# EasyEDA schematic 1-Schematic_OSAB-RP2040-Mainboard-v1.0.0.json
TITLE: OSAB Mainboard [RP2040]; REV: 1.0.0; Date: 2024-08-22; Sheet: 1/1; Drawn By: Michael MacDonald; Company: OSAB Project
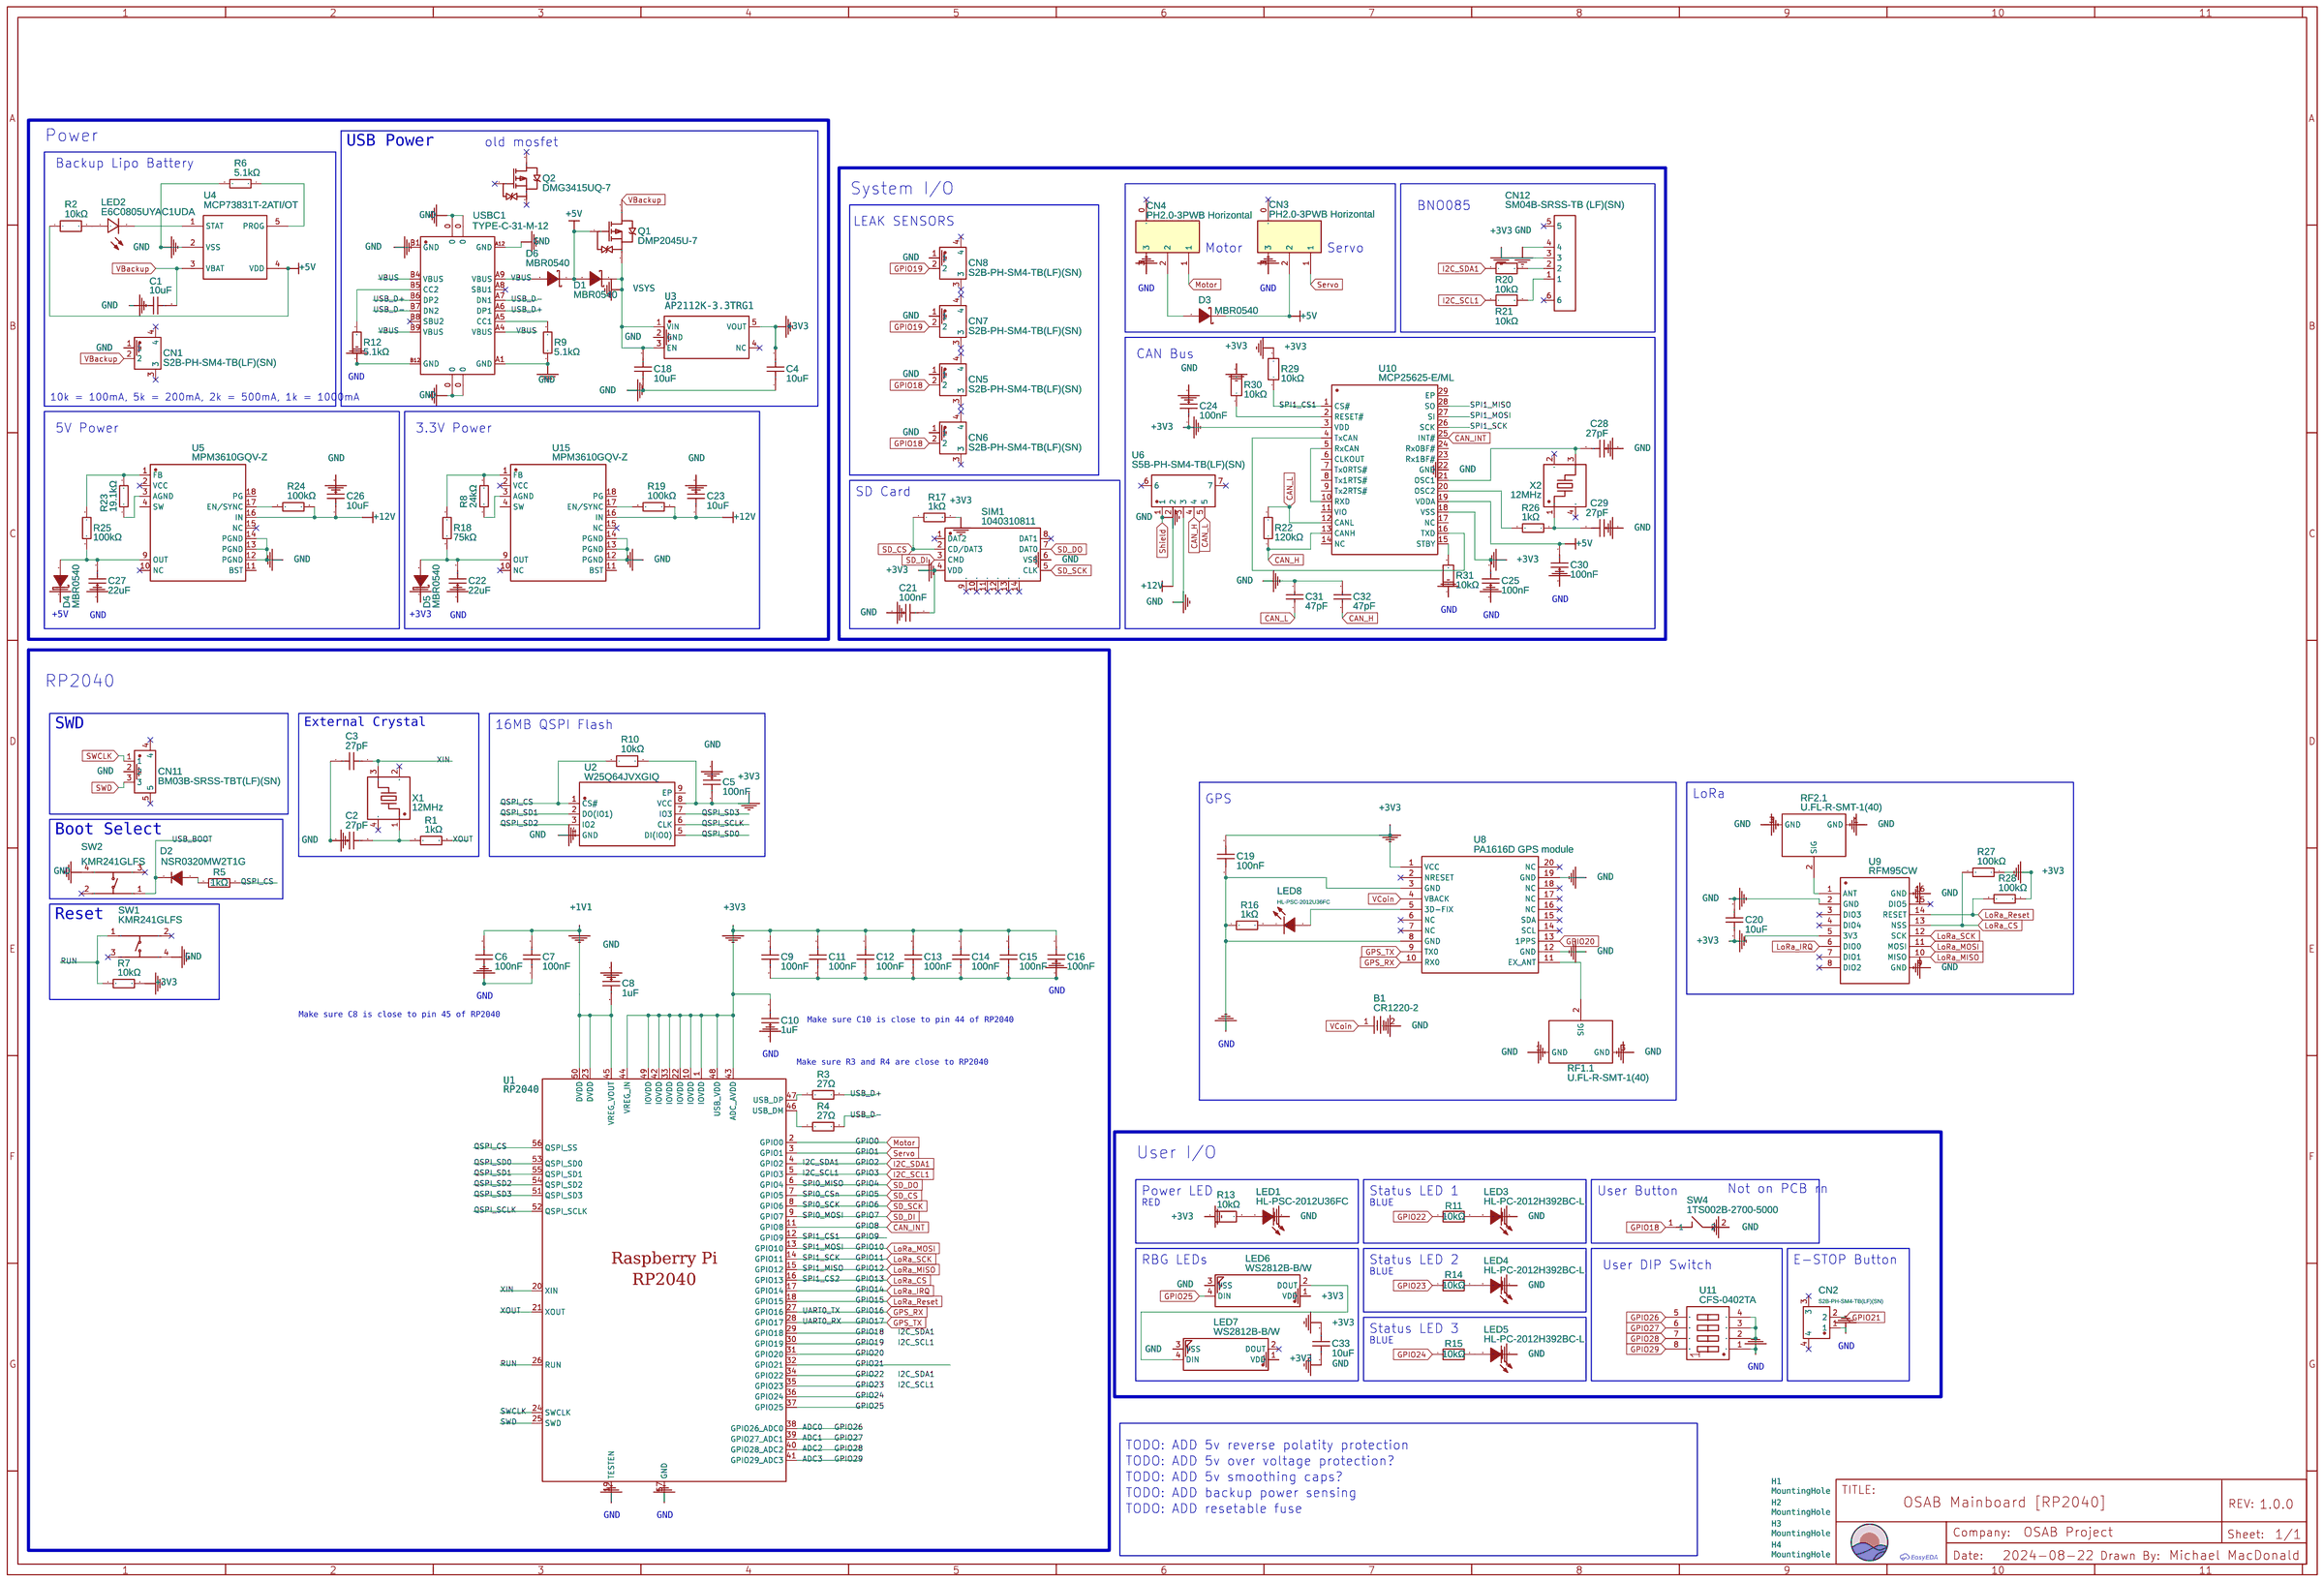
[diagram p0: schematic sheet]

## Parts
B1  CR1220-2  [BAT-SMD_CR1220-2]
C1  10uF  [C0603]
C2  27pF  [C0402]
C3  27pF  [C0402]
C4  10uF  [C0603]
C5  100nF  [C0402]
C6  100nF  [C0402]
C7  100nF  [C0402]
C8  1uF  [C0402]
C9  100nF  [C0402]
C10  1uF  [C0402]
C11  100nF  [C0402]
C12  100nF  [C0402]
C13  100nF  [C0402]
C14  100nF  [C0402]
C15  100nF  [C0402]
C16  100nF  [C0402]
C18  10uF  [C0603]
C19  100nF  [C0402]
C20  10uF  [C0603]
C21  100nF  [C0402]
C22  22uF  [C0603]
C23  10uF  [C0603]
C24  100nF  [C0402]
C25  100nF  [C0402]
C26  10uF  [C0603]
C27  22uF  [C0603]
C28  27pF  [C0402]
C29  27pF  [C0402]
C30  100nF  [C0402]
C31  47pF  [C0603]
C32  47pF  [C0603]
C33  10uF  [C0603]
CN1  S2B-PH-SM4-TB(LF)(SN)  [CONN-SMD_P2.00_S2B-PH-SM4-TB-LF-SN]
CN2  S2B-PH-SM4-TB(LF)(SN)  [CONN-SMD_P2.00_S2B-PH-SM4-TB-LF-SN]
CN3  PH2.0-3PWB Horizontal  [CONN-TH_PH-3PWB]
CN4  PH2.0-3PWB Horizontal  [CONN-TH_PH-3PWB]
CN5  S2B-PH-SM4-TB(LF)(SN)  [CONN-SMD_P2.00_S2B-PH-SM4-TB-LF-SN]
CN6  S2B-PH-SM4-TB(LF)(SN)  [CONN-SMD_P2.00_S2B-PH-SM4-TB-LF-SN]
CN7  S2B-PH-SM4-TB(LF)(SN)  [CONN-SMD_P2.00_S2B-PH-SM4-TB-LF-SN]
CN8  S2B-PH-SM4-TB(LF)(SN)  [CONN-SMD_P2.00_S2B-PH-SM4-TB-LF-SN]
CN11  BM03B-SRSS-TBT(LF)(SN)  [CONN-SMD_BM03B-SRSS-TBT-LF-SN]
CN12  SM04B-SRSS-TB (LF)(SN)  [CONN-SMD_4P-P1.00_SM04B-SRSS-TB-LF-SN]
D1  MBR0540  [SOD-123FL_L2.7-W1.8-LS3.8-RD]
D2  NSR0320MW2T1G  [SOD-323_L1.8-W1.3-LS2.5-RD]
D3  MBR0540  [SOD-123FL_L2.7-W1.8-LS3.8-RD]
D4  MBR0540  [SOD-123FL_L2.7-W1.8-LS3.8-RD]
D5  MBR0540  [SOD-123FL_L2.7-W1.8-LS3.8-RD]
D6  MBR0540  [SOD-123FL_L2.7-W1.8-LS3.8-RD]
H1  MountingHole  [MOUNTINGHOLE_2.7MM_M2.5]
H2  MountingHole  [MOUNTINGHOLE_2.7MM_M2.5]
H3  MountingHole  [MOUNTINGHOLE_2.7MM_M2.5]
H4  MountingHole  [MOUNTINGHOLE_2.7MM_M2.5]
LED1  HL-PSC-2012U36FC  [LED0805-RD_RED]
LED2  E6C0805UYAC1UDA  [LED0805-R-RD]
LED3  HL-PC-2012H392BC-L  [LED0805-RD_BLUE]
LED4  HL-PC-2012H392BC-L  [LED0805-RD_BLUE]
LED5  HL-PC-2012H392BC-L  [LED0805-RD_BLUE]
LED6  WS2812B-B/W  [LED-SMD_4P-L5.0-W5.0-TL_WS2812B-B]
LED7  WS2812B-B/W  [LED-SMD_4P-L5.0-W5.0-TL_WS2812B-B]
LED8  HL-PSC-2012U36FC  [LED0805-RD_RED]
Q1  DMP2045U-7  [SOT-23-3_L2.9-W1.3-P1.90-LS2.4-BR-CW]
Q2  DMG3415UQ-7  [SOT-23-3_L2.9-W1.6-P1.90-LS2.8-BR]
R1  1kΩ  [R0603]
R2  10kΩ  [R0603]
R3  27Ω  [R0402]
R4  27Ω  [R0402]
R5  1kΩ  [R0603]
R6  5.1kΩ  [R0603]
R7  10kΩ  [R0603]
R8  24kΩ  [R0603]
R9  5.1kΩ  [R0603]
R10  10kΩ  [R0603]
R11  10kΩ  [R0603]
R12  5.1kΩ  [R0603]
R13  10kΩ  [R0603]
R14  10kΩ  [R0603]
R15  10kΩ  [R0603]
R16  1kΩ  [R0603]
R17  1kΩ  [R0603]
R18  75kΩ  [R0603]
R19  100kΩ  [R0603]
R20  10kΩ  [R0603]
R21  10kΩ  [R0603]
R22  120kΩ  [R0603]
R23  19.1kΩ  [R0603]
R24  100kΩ  [R0603]
R25  100kΩ  [R0603]
R26  1kΩ  [R0603]
R27  100kΩ  [R0603]
R28  100kΩ  [R0603]
R29  10kΩ  [R0603]
R30  10kΩ  [R0603]
R31  10kΩ  [R0603]
RF1  U.FL-R-SMT-1(40)  [ANT-SMD_UFL-R-SMT-1]  (section 1)
RF2  U.FL-R-SMT-1(40)  [ANT-SMD_UFL-R-SMT-1]  (section 1)
SIM1  1040310811  [SIM-SMD_8P-1040310811]
SW1  KMR241GLFS  [KEY-SMD_4P-L4.2-W2.8-P1.60-LS4.6]
SW2  KMR241GLFS  [KEY-SMD_4P-L4.2-W2.8-P1.60-LS4.6]
SW4  1TS002B-2700-5000  [SW-SMD_L6.0-W3.5-LS8.0]
U1  RP2040  [LQFN-56_L7.0-W7.0-P0.4-EP]
U2  W25Q64JVXGIQ  [XSON-8_L4.0-W4.0-P0.80-TL-EP]
U3  AP2112K-3.3TRG1  [SOT-25-5_L3.0-W1.8-P0.95-LS3.0-BR]
U4  MCP73831T-2ATI/OT  [SOT-23-5_L3.0-W1.7-P0.95-LS2.8-BR]
U5  MPM3610GQV-Z  [QFN-20_L5.0-W3.0-TL-MPM3610GQV-Z]
U6  S5B-PH-SM4-TB(LF)(SN)  [CONN-SMD_S5B-PH-SM4-TB-LF-SN]
U8  PA1616D GPS module  [PA1616D GPS MODULE]
U9  RFM95CW  [RFM95CW]
U10  MCP25625-E/ML  [QFN-28_L6.0-W6.0-P0.65-BL-EP]
U11  CFS-0402TA  [SW-SMD_8P-L11.1-W6.2-P2.54-LS7.8]
U15  MPM3610GQV-Z  [QFN-20_L5.0-W3.0-TL-MPM3610GQV-Z]
USBC1  TYPE-C-31-M-12  [USB-C_SMD-TYPE-C-31-M-12]
X1  12MHz  [CRYSTAL-SMD_4P-L3.2-W2.5-BL]
X2  12MHz  [CRYSTAL-SMD_4P-L3.2-W2.5-BL]

## Library data of the parts
B1 = CR1220-2: Supplier: LCSC; Manufacturer: Q&J; image: //image.lceda.cn/szlcsc/C70381.jpg; Supplier Part: C70381
C1 C4 C18 C20 C23 C26 C33 = CSA0603X5R106M6R3JT: Contributor: lcsc; Supplier: LCSC; Supplier Part: C3015157; Manufacturer: HRE(芯声); JLCPCB Part Class: Extended Part
C2 C3 C28 C29 = GJM1555C1H270JB01D: Supplier: LCSC; Manufacturer: muRata(村田); Supplier Part: C88884; JLCPCB Part Class: Extended Part
C5-C7 C9 C11-C16 C19 C21 C24 C25 C30 = GCM155R71C104KA55D: Supplier: LCSC; Manufacturer: muRata(村田); Supplier Part: C85857; JLCPCB Part Class: Extended Part
C8 C10 = TCC0402X5R105K100AT: Contributor: LCSC; Supplier: LCSC; Supplier Part: C380293; Manufacturer: CCTC(三环); JLCPCB Part Class: Extended Part
C22 C27 = CL10A226MQ8NRNC: Supplier: LCSC; Manufacturer: SAMSUNG(三星); Supplier Part: C59461; JLCPCB Part Class: Basic Part
C31 C32 = CL10C470JB8NNNC: Supplier: LCSC; Manufacturer: SAMSUNG(三星); Supplier Part: C1671; JLCPCB Part Class: Basic Part
CN1 CN2 CN5-CN8 = S2B-PH-SM4-TB(LF)(SN): Contributor: LCSC; Supplier: LCSC; Supplier Part: C295747; Manufacturer: JST; JLCPCB Part Class: Extended Part
CN3 CN4 = PH2.0-3PWB Horizontal: Supplier: LCSC; Manufacturer: BOOMELE(博穆精密); Manufacturer Part: PH-3P卧贴; Supplier Part: C81626; JLCPCB Part Class: Extended Part
CN11 = BM03B-SRSS-TBT(LF)(SN): Contributor: LCSC; Supplier: LCSC; Supplier Part: C495538; Manufacturer: JST; JLCPCB Part Class: Extended Part
CN12 = SM04B-SRSS-TB (LF)(SN): Contributor: LCSC; Supplier: LCSC; Supplier Part: C160404; Manufacturer: JST; Manufacturer Part: SM04B-SRSS-TB(LF)(SN); JLCPCB Part Class: Extended Part
D1 D3-D6 = MBR0540: Contributor: LCSC; Supplier: LCSC; Supplier Part: C116159; Manufacturer: SHIKUES(时科); JLCPCB Part Class: Extended Part
D2 = NSR0320MW2T1G: Supplier: LCSC; Manufacturer: onsemi(安森美); Supplier Part: C48192; JLCPCB Part Class: Extended Part
LED1 LED8 = HL-PSC-2012U36FC: Contributor: LCSC; Supplier: LCSC; Supplier Part: C497949; Manufacturer: HONGLITRONIC(鸿利光电); JLCPCB Part Class: Extended Part
LED2 = E6C0805UYAC1UDA: Contributor: LCSC; Supplier: LCSC; Supplier Part: C375452; Manufacturer: ekinglux(亿晶源); JLCPCB Part Class: Extended Part
LED3-LED5 = HL-PC-2012H392BC-L: Contributor: LCSC; Supplier: LCSC; Supplier Part: C497943; Manufacturer: HONGLITRONIC(鸿利光电); JLCPCB Part Class: Extended Part
LED6 LED7 = WS2812B-B/W: Contributor: LCSC; Supplier: LCSC; Supplier Part: C2761795; Manufacturer: worldsemi; Manufacturer Part: WS2812B-B/T; JLCPCB Part Class: Extended Part
Q1 = DMP2045U-7: Contributor: LCSC; Supplier: LCSC; Supplier Part: C459541; Manufacturer: DIODES(美台); JLCPCB Part Class: Extended Part
Q2 = DMG3415UQ-7: Contributor: LCSC; Supplier: LCSC; Supplier Part: C459537; Manufacturer: DIODES(美台); JLCPCB Part Class: Extended Part
R1 R5 R16 R17 R26 = 0603WAF1001T5E: Supplier: LCSC; Manufacturer: UNI-ROYAL(厚声); Supplier Part: C21190; JLCPCB Part Class: Basic Part
R2 R10 R11 R13-R15 R20 R21 R29-R31 = FRC0603F1002TS: Contributor: LCSC; Supplier: LCSC; Supplier Part: C2906982; Manufacturer: FOJAN(富捷); JLCPCB Part Class: Extended Part
R3 R4 = 0402WGJ0270TCE: Supplier: LCSC; Manufacturer: UNI-ROYAL(厚声); Supplier Part: C25156; JLCPCB Part Class: Extended Part
R6 R9 R12 = ARG03DTC5101: Contributor: LCSC; Supplier: LCSC; Supplier Part: C311919; Manufacturer: Viking(光颉); JLCPCB Part Class: Extended Part
R7 = 0603WAF1002T5E: Supplier: LCSC; Manufacturer: UNI-ROYAL(厚声); Supplier Part: C25804; JLCPCB Part Class: Basic Part
R8 = 0603WAF2402T5E: Supplier: LCSC; Manufacturer: UNI-ROYAL(厚声); Supplier Part: C23352; JLCPCB Part Class: Basic Part
R18 = 0603WAF7502T5E: Supplier: LCSC; Manufacturer: UNI-ROYAL(厚声); Supplier Part: C23242; JLCPCB Part Class: Basic Part
R19 R24 R25 R27 R28 = 0603WAF1003T5E: Supplier: LCSC; Manufacturer: UNI-ROYAL(厚声); Supplier Part: C25803; JLCPCB Part Class: Basic Part
R22 = 0603WAF1203T5E: Supplier: LCSC; Manufacturer: UNI-ROYAL(厚声); Supplier Part: C25808; JLCPCB Part Class: Basic Part
R23 = RMC060319.1K1%N: Contributor: LCSC; Supplier: LCSC; Supplier Part: C269469; Manufacturer: Tyohm(幸亚电阻); JLCPCB Part Class: Extended Part
RF1 RF2 = U.FL-R-SMT-1(40): Contributor: LCSC; subpart_no: 1; Supplier: LCSC; Supplier Part: C434816; Manufacturer: HRS(广濑); JLCPCB Part Class: Extended Part
SIM1 = 1040310811: Contributor: LCSC; Supplier: LCSC; Supplier Part: C585350; Manufacturer: MOLEX; JLCPCB Part Class: Extended Part
SW1 SW2 = KMR241GLFS: Contributor: LCSC; Supplier: LCSC; Supplier Part: C221682; Manufacturer: C&K; JLCPCB Part Class: Extended Part
SW4 = 1TS002B-2700-5000: Contributor: LCSC; Supplier: LCSC; Supplier Part: C318844; Manufacturer: HYP(鸿源精密); Manufacturer Part: 1TS002B-2700-5000-CT; JLCPCB Part Class: Extended Part
U1 = RP2040: Supplier: LCSC; Supplier Part: C2040; Manufacturer: Raspberry Pi(树莓派); JLCPCB Part Class: Extended Part; Contributor: LCSC
U2 = W25Q64JVXGIQ: Contributor: LCSC; Supplier: LCSC; Supplier Part: C2940195; Manufacturer: WINBOND(华邦); JLCPCB Part Class: Extended Part
U3 = AP2112K-3.3TRG1: Supplier: LCSC; Manufacturer: DIODES; Contributor: LCSC; Supplier Part: C51118; JLCPCB Part Class: Extended Part
U4 = MCP73831T-2ATI/OT: Supplier: LCSC; Manufacturer: MICROCHIP(美国微芯); Supplier Part: C14879; JLCPCB Part Class: Extended Part
U5 U15 = MPM3610GQV-Z: Contributor: lcsc; Supplier: LCSC; Supplier Part: C5183856; Manufacturer: MPS(芯源); JLCPCB Part Class: Extended Part
U6 = S5B-PH-SM4-TB(LF)(SN): Contributor: LCSC; Supplier: LCSC; Supplier Part: C265104; Manufacturer: JST; JLCPCB Part Class: Extended Part
U8 = PA1616D GPS module: Contributor: wthompson9
U9 = RFM95CW: Manufacturer: Hoperf; Supplier: Digi-Key; link: https://www.digikey.com/en/products/detail/sparkfun-electronics/COM-18085/14309086?s=N4IgTCBcDaIEoDECyBOArAYQOogLoF8g; Contributor: waruma
U10 = MCP25625-E/ML: Contributor: LCSC; Supplier: LCSC; Supplier Part: C481365; Manufacturer: MICROCHIP(美国微芯); JLCPCB Part Class: Extended Part
U11 = CFS-0402TA: Supplier: LCSC; Supplier Part: C2921586; Manufacturer: NIDEC(尼得科); JLCPCB Part Class: Extended Part; Contributor: lcsc
USBC1 = TYPE-C-31-M-12: Supplier: LCSC; Supplier Part: C165948; Manufacturer: Rectangular Connectors - Contacts; Contributor: LCSC; JLCPCB Part Class: Extended Part
X1 X2 = NX3225SA-12MHZ-STD-CSR-6: Contributor: LCSC; Supplier: LCSC; Supplier Part: C481400; Manufacturer: NDK; Manufacturer Part: NX3225SA-12MHz-STD-CSR-6; JLCPCB Part Class: Extended Part

## Nets
+1V1: C6.2 C7.2 C8.2 U1.23(DVDD) U1.45(VREG_VOUT) U1.50(DVDD)
+3V3: C4.2 C5.1 C9.2 C10.2 C11.2 C12.2 C13.2 C14.2 C15.2 C16.2 C19.2 C20.1 C21.1 C24.1 C25.1 C33.2 CN12.3 D5.1(K) LED6.1(VDD) LED7.1(VDD) R7.2 R10.2 R13.1 R17.2 R27.1 R28.1 R29.2 R30.2 SIM1.4(VDD) U1.1(IOVDD) U1.10(IOVDD) U1.22(IOVDD) U1.33(IOVDD) U1.42(IOVDD) U1.43(ADC_AVDD) U1.44(VREG_IN) U1.48(USB_VDD) U1.49(IOVDD) U2.8(VCC) U3.5(VOUT) U8.1(VCC) U9.5(3V3) U10.3(VDD) U10.18(VSS)
+5V: C30.1 CN3.2 D1.2(A) D3.1(K) D4.1(K) D6.1(K) Q1.1(G) R2.1 U4.4(VDD) U10.19(VDDA)
+12V: C23.1 C26.1 R19.1 R24.1 U5.16(IN) U6.2 U15.16(IN)
GND: B1.2 C1.1 C2.1 C3.1 C4.1 C5.2 C6.1 C7.1 C8.1 C9.1 C10.1 C11.1 C12.1 C13.1 C14.1 C15.1 C16.1 C18.1 C19.1 C20.2 C21.2 C22.1 C23.2 C24.2 C25.2 C26.2 C27.1 C28.1 C29.1 C30.2 C31.2 C32.2 C33.1 CN1.1 CN2.1 CN3.3 CN4.3 CN5.1 CN6.1 CN7.1 CN8.1 CN11.2 CN12.4 LED1.1(C) LED3.1(K) LED4.1(K) LED5.1(K) LED6.3(VSS) LED7.3(VSS) R6.2 R9.1 R12.1 R16.1 R31.1 RF1.1(GND) RF1.3(GND) RF2.1(GND) RF2.3(GND) SIM1.6(VSS) SW1.4 SW2.4 SW4.2 U1.19(TESTEN) U1.57(GND) U2.4(GND) U3.2(GND) U4.2(VSS) U5.12(PGND) U5.13(PGND) U5.14(PGND) U6.1 U6.3 U8.3(GND) U8.8(GND) U8.12(GND) U8.19(GND) U9.2(GND) U9.9(GND) U9.16(GND) U10.22(GND) U11.1(PIN1) U11.2(PIN2) U11.3(PIN3) U11.4(PIN4) U15.12(PGND) U15.13(PGND) U15.14(PGND) USBC1.0 USBC1.A1(GND) USBC1.A12(GND) USBC1.B1(GND) USBC1.B12(GND)
VBUS: D6.2(A) USBC1.A4(VBUS) USBC1.A9(VBUS) USBC1.B4(VBUS) USBC1.B9(VBUS)
ADC0: U1.38(GPIO26_ADC0) U11.5(PIN5)
ADC1: U1.39(GPIO27_ADC1) U11.6(PIN6)
ADC2: U1.40(GPIO28_ADC2) U11.7(PIN7)
ADC3: U1.41(GPIO29_ADC3) U11.8(PIN8)
CAN_H: C32.1 R22.1 U6.4 U10.13(CANH)
CAN_INT: U1.11(GPIO8) U10.25(INT#)
CAN_L: C31.1 R22.2 U6.5 U10.12(CANL)
GPIO0: CN4.1 U1.2(GPIO0)
GPIO1: CN3.1 U1.3(GPIO1)
GPIO2: R20.1 U1.4(GPIO2)
GPIO3: R21.1 U1.5(GPIO3)
GPIO4: SIM1.7(DAT0) U1.6(GPIO4)
GPIO5: R17.1 SIM1.2(CD/DAT3) U1.7(GPIO5)
GPIO6: SIM1.5(CLK) U1.8(GPIO6)
GPIO7: SIM1.3(CMD) U1.9(GPIO7)
GPIO9: R29.1 U1.12(GPIO9) U10.1(CS#)
GPIO10: U1.13(GPIO10) U9.11(MOSI) U10.27(SI)
GPIO11: U1.14(GPIO11) U9.12(SCK) U10.26(SCK)
GPIO12: U1.15(GPIO12) U9.10(MISO) U10.28(SO)
GPIO13: R27.2 U1.16(GPIO13) U9.13(NSS)
GPIO14: U1.17(GPIO14) U9.6(DIO0)
GPIO15: R28.2 U1.18(GPIO15) U9.14(RESET)
GPIO16: U1.27(GPIO16) U8.10(RX0)
GPIO17: U1.28(GPIO17) U8.9(TX0)
GPIO18: CN5.2 CN6.2 SW4.1 U1.29(GPIO18)
GPIO19: CN7.2 CN8.2 U1.30(GPIO19)
GPIO20: U1.31(GPIO20) U8.13(1PPS)
GPIO21: CN2.2 U1.32(GPIO21)
GPIO22: R11.1 U1.34(GPIO22)
GPIO23: R14.1 U1.35(GPIO23)
GPIO24: R15.1 U1.36(GPIO24)
GPIO25: LED6.4(DIN) U1.37(GPIO25)
QSPI_CS: R5.2 R10.1 U1.56(QSPI_SS) U2.1(CS#)
QSPI_SCLK: U1.52(QSPI_SCLK) U2.6(CLK)
QSPI_SD0: U1.53(QSPI_SD0) U2.5(DI(IO0))
QSPI_SD1: U1.55(QSPI_SD1) U2.2(DO(IO1))
QSPI_SD2: U1.54(QSPI_SD2) U2.3(IO2)
QSPI_SD3: U1.51(QSPI_SD3) U2.7(IO3)
RUN: R7.1 SW1.1 U1.26(RUN)
SWCLK: CN11.1 U1.24(SWCLK)
SWD: CN11.3 U1.25(SWD)
USB_BOOT: D2.1(C) SW2.1
USB_D+: R3.2 USBC1.A6(DP1) USBC1.B6(DP2)
USB_D-: R4.2 USBC1.A7(DN1) USBC1.B7(DN2)
VBackup: C1.2 CN1.2 Q1.2(D) U4.3(VBAT)
VCoin: B1.1 U8.4(VBACK)
VSYS: C18.2 D1.1(K) Q1.3(S) U3.1(VIN) U3.3(EN)
XIN: C3.2 U1.20(XIN) X1.3
XOUT: R1.2 U1.21(XOUT)
Net-(C2-2): C2.2 R1.1 X1.1
Net-(C22-2): C22.2 D5.2(A) R18.1 U15.9(OUT)
Net-(C27-2): C27.2 D4.2(A) R25.1 U5.9(OUT)
Net-(C28-2): C28.2 U10.21(OSC1) X2.3
Net-(C29-2): C29.2 R26.1 X2.1
Net-(CN4-2): CN4.2 D3.2(A)
Net-(CN12-1): CN12.1 R21.2
Net-(CN12-2): CN12.2 R20.2
Net-(D2-2): D2.2(A) R5.1
Net-(LED1-2): LED1.2(A) R13.2
Net-(LED2-1): LED2.1(+) R2.2
Net-(LED2-2): LED2.2(-) U4.1(STAT)
Net-(LED3-2): LED3.2(A) R11.2
Net-(LED4-2): LED4.2(A) R14.2
Net-(LED5-2): LED5.2(A) R15.2
Net-(LED6-2): LED6.2(DOUT) LED7.4(DIN)
Net-(LED8-1): LED8.1(C) R16.2
Net-(LED8-2): LED8.2(A) U8.5(3D-FIX)
Net-(R3-1): R3.1 U1.47(USB_DP)
Net-(R4-1): R4.1 U1.46(USB_DM)
Net-(R6-1): R6.1 U4.5(PROG)
Net-(R8-1): R8.1 U15.3(AGND)
Net-(R8-2): R8.2 R18.2 U15.1(FB)
Net-(R9-2): R9.2 USBC1.A5(CC1)
Net-(R12-2): R12.2 USBC1.B5(CC2)
Net-(R19-2): R19.2 U15.17(EN/SYNC)
Net-(R23-1): R23.1 U5.3(AGND)
Net-(R23-2): R23.2 R25.2 U5.1(FB)
Net-(R24-2): R24.2 U5.17(EN/SYNC)
Net-(R26-2): R26.2 U10.20(OSC2)
Net-(R30-1): R30.1 U10.2(RESET#)
Net-(R31-2): R31.2 U10.15(STBY)
Net-(RF1.1-2): RF1.2(SIG) U8.11(EX_ANT)
Net-(RF2.1-2): RF2.2(SIG) U9.1(ANT)
Net-(U10-4): U10.4(TxCAN) U10.16(TXD)
Net-(U10-5): U10.5(RxCAN) U10.10(RXD)

Not connected (* = marked no-connect by the designer): CN1 3* 4*; CN2 3* 4*; CN3 0*; CN4 0*; CN5 3* 4*; CN6 3* 4*; CN7 3* 4*; CN8 3* 4*; CN11 4* 5*; CN12 5* 6*; LED7 2(DOUT)*; Q2 1(G)* 2(S)* 3(D)*; SIM1 1(DAT2)* 8(DAT1)* 9* 10* 11* 12* 13* 14*; SW1 2* 3*; SW2 2* 3*; U2 9(EP); U3 4(NC)*; U5 2(VCC)* 4(SW) 10(NC)* 11(BST) 15(NC)* 18(PG); U6 6* 7*; U8 2(NRESET)* 6(NC)* 7(NC)* 14(SCL)* 15(SDA)* 16(NC)* 17(NC)* 18(NC)* 20(NC)*; U9 3(DIO3)* 4(DIO4)* 7(DIO1)* 8(DIO2)* 15(DIO5)*; U10 6(CLKOUT) 7(Tx0RTS#) 8(Tx1RTS#) 9(Tx2RTS#) 11(VIO) 14(NC) 17(NC) 23(Rx1BF#) 24(Rx0BF#) 29(EP); U15 2(VCC)* 4(SW) 10(NC)* 11(BST) 15(NC)* 18(PG); USBC1 A8(SBU1)* B8(SBU2)*; X1 2(GND)* 4(GND)*; X2 2(GND)* 4(GND)*

## Notes on the sheet
- Power
- USB Power
- old mosfet
- Backup Lipo Battery
- System I/O
- BNO085
- LEAK SENSORS
- Motor
- Servo
- CAN Bus
- 10k = 100mA, 5k = 200mA, 2k = 500mA, 1k = 1000mA
- 5V Power
- 3.3V Power
- SD Card
- RP2040
- SWD
- External Crystal
- 16MB QSPI Flash
- GPS
- LoRa
- Boot Select
- Reset
- Make sure C8 is close to pin 45 of RP2040
- Make sure C10 is close to pin 44 of RP2040
- Make sure R3 and R4 are close to RP2040
- User I/O
- Not on PCB rn
- Power LED
- Status LED 1
- User Button
- RED
- BLUE
- RBG LEDs
- Status LED 2
- User DIP Switch
- E-STOP Button
- BLUE
- Status LED 3
- BLUE
- TODO: ADD 5v reverse polatity protection
- TODO: ADD 5v over voltage protection?
- TODO: ADD 5v smoothing caps?
- TODO: ADD backup power sensing
- TODO: ADD resetable fuse
